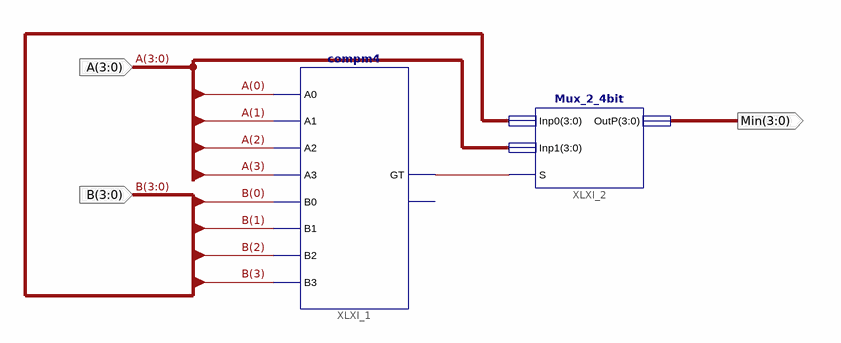
[diagram p0: schematic sheet 1]
// Xilinx ISE schematic Max_4bit.sch (spartan3e) as structural Verilog: 2 symbols, 3 ports
module Max_4bit (
  input  [3:0] A,
  input  [3:0] B,
  output [3:0] Min
);

  wire XLXN_14;

  compm4 XLXI_1 (
    .A0(A[0]), .A1(A[1]), .A2(A[2]), .A3(A[3]), .B0(B[0]), .B1(B[1]), .B2(B[2]), .B3(B[3]), .GT(XLXN_14));  // open: LT
  Mux_2_4bit XLXI_2 (.Inp0(B), .Inp1(A), .OutP(Min), .S(XLXN_14));
endmodule
